# Altium schematic sheet POWER_IO.SchDoc
size A4
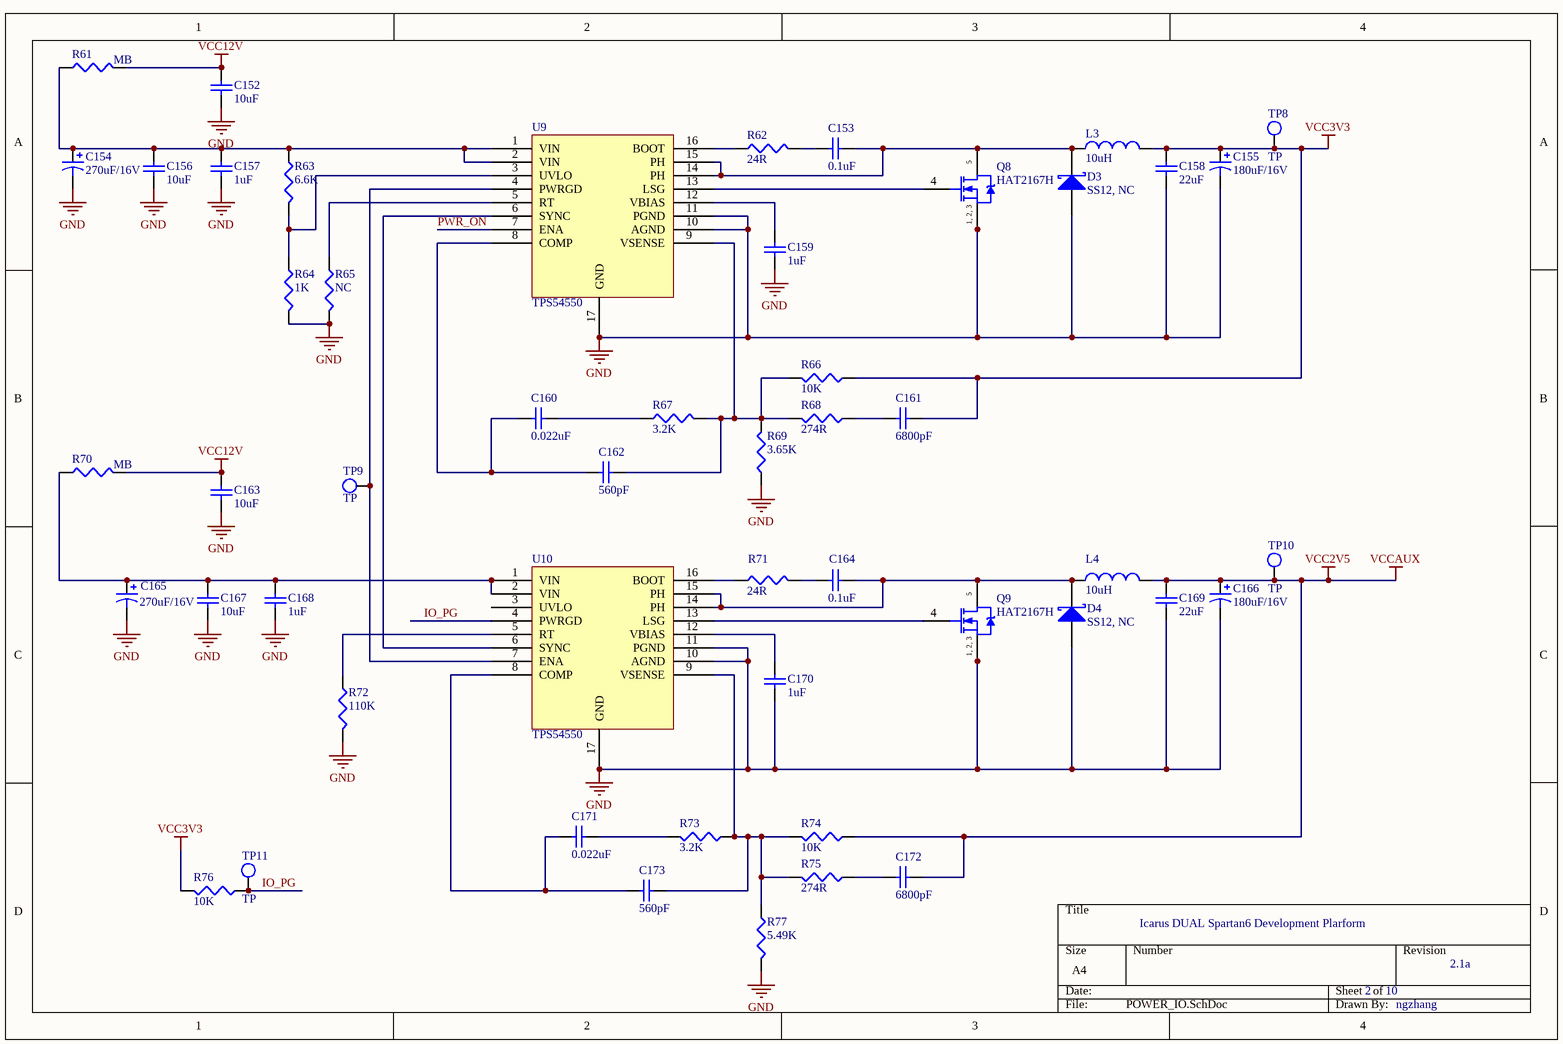
[diagram p0: POWER_IO.SchDoc]

## Parts
C152  10uF  [C1206]
C153  0.1uF  [1608[0603]]
C154  270uF/16V  [CAP8X8]
C155  180uF/16V  [CAP8X8]
C156  10uF  [C1206]
C157  1uF  [1608[0603]]
C158  22uF  [C1206]
C159  1uF  [1608[0603]]
C160  0.022uF  [1608[0603]]
C161  6800pF  [1608[0603]]
C162  560pF  [1608[0603]]
C163  10uF  [C1206]
C164  0.1uF  [1608[0603]]
C165  270uF/16V  [CAP8X8]
C166  180uF/16V  [CAP8X8]
C167  10uF  [C1206]
C168  1uF  [1608[0603]]
C169  22uF  [C1206]
C170  1uF  [1608[0603]]
C171  0.022uF  [1608[0603]]
C172  6800pF  [1608[0603]]
C173  560pF  [1608[0603]]
D3  SS12, NC  [SMA]
D4  SS12, NC  [SMA]
L3  value 10uH  [IHLP4040]  (hidden comment: IHLP4040DZ11)
L4  value 10uH  [IHLP4040]  (hidden comment: IHLP4040DZ11)
Q8  HAT2167H  [LFPAK]
Q9  HAT2167H  [LFPAK]
R61  MB  [C1206]
R62  24R  [J1-0603]
R63  6.6K  [J1-0603]
R64  1K  [J1-0603]
R65  NC  [J1-0603]
R66  10K  [J1-0603]
R67  3.2K  [J1-0603]
R68  274R  [J1-0603]
R69  3.65K  [J1-0603]
R70  MB  [C1206]
R71  24R  [J1-0603]
R72  110K  [J1-0603]
R73  3.2K  [J1-0603]
R74  10K  [J1-0603]
R75  274R  [J1-0603]
R76  10K  [J1-0603]
R77  5.49K  [J1-0603]
TP8  TP  [TP]
TP9  TP  [TP]
TP10  TP  [TP]
TP11  TP  [TP]
U9  TPS54550  [TSSOP16_PP]
U10  TPS54550  [TSSOP16_PP]

## Nets
GND: C152.1 C154.2 C155.2 C156.1 C157.1 C158.1 C159.1 C163.1 C165.2 C166.2 C167.1 C168.1 C169.1 C170.2 D3.1(A) D4.1(A) Q8.1(S) Q8.2(S) Q8.3(S) Q9.1(S) Q9.2(S) Q9.3(S) R64.2 R65.2 R69.1 R72.2 R77.2 U9.10(AGND) U9.11(PGND) U9.17(GND) U10.10(AGND) U10.11(PGND) U10.17(GND)
VCC2V5: C166.1 C169.2 C172.2 L4.2 R74.1 TP10.1(TP)  [also labelled VCCAUX]
VCC3V3: C155.1 C158.2 C161.2 L3.2 R66.1 R76.2 TP8.1(TP)
VCC12V: C152.2 C163.2 R61.2 R70.2
IO_PG: R76.1 TP11.1(TP) U10.4(PWRGD)
PWR_ON: U9.7(ENA)
NetC153_1: C153.1 R62.2
NetC153_2: C153.2 D3.2(K) L3.1 Q8.5(D) U9.14(PH) U9.15(PH)
NetC154_1: C154.1 C156.2 C157.2 R61.1 R63.1 U9.1(VIN) U9.2(VIN)
NetC159_2: C159.2 U9.12(VBIAS)
NetC160_1: C160.1 C162.1 U9.8(COMP)
NetC160_2: C160.2 R67.1
NetC161_1: C161.1 R68.1
NetC162_2: C162.2 R66.2 R67.2 R68.2 R69.2 U9.9(VSENSE)
NetC164_1: C164.1 D4.2(K) L4.1 Q9.5(D) U10.14(PH) U10.15(PH)
NetC164_2: C164.2 R71.2
NetC165_1: C165.1 C167.2 C168.2 R70.1 U10.1(VIN) U10.2(VIN)
NetC170_1: C170.1 U10.12(VBIAS)
NetC171_1: C171.1 C173.1 U10.8(COMP)
NetC171_2: C171.2 R73.2
NetC172_1: C172.1 R75.1
NetC173_2: C173.2 R73.1 R74.2 R75.2 R77.1 U10.9(VSENSE)
NetQ8_4: Q8.4(G) U9.13(LSG)
NetQ9_4: Q9.4(G) U10.13(LSG)
NetR62_1: R62.1 U9.16(BOOT)
NetR63_2: R63.2 R64.1 U9.3(UVLO)
NetR65_1: R65.1 U9.5(RT)
NetR71_1: R71.1 U10.16(BOOT)
NetR72_1: R72.1 U10.5(RT)
NetTP9_1: TP9.1(TP) U9.4(PWRGD) U10.7(ENA)
NetU9_6: U9.6(SYNC) U10.6(SYNC)

Not connected (* = marked no-connect by the designer): U10 3(UVLO)

## Notes on the sheet
- Icarus DUAL Spartan6 Development Plarform
- 2
- 10
- 2.1a
- ngzhang
- (in symbol HAT216X) 1, 2, 3

## Library data of the parts
C152 C153 C156-C164 C167-C173 = Cap Semi: Capacitor (Semiconductor SIM Model); Published: 8-Jun-2000; LatestRevisionDate: 29-May-2009; LatestRevisionNote: IPC-7351 Footprint Added.; PackageReference: C1206; Publisher: Altium Limited; PackageDescription: Chip Capacitor
  C152 C156 C163 C167: Value: 10uF
  C153 C164: Value: 0.1uF
  C157 C159 C168 C170: Value: 1uF
  C158 C169: Value: 22uF
  C160 C171: Value: 0.022uF
  C161 C172: Value: 6800pF
  C162 C173: Value: 560pF
C154 C155 C165 C166 = Cap Pol3: Polarized Capacitor (Surface Mount); Published: 8-Jun-2000; LatestRevisionDate: 29-May-2009; LatestRevisionNote: IPC-7351 Footprint Added.; PackageReference: C0805; Publisher: Altium Limited; PackageDescription: Chip Capacitor
  C154 C165: Value: 270uF/16V
  C155 C166: Value: 180uF/16V
D3 D4 = 10MQ060N: Schottky Rectifier; Published: 17-Sep-2003; DatasheetVersion: May-2002; PackageVersion: revH, May-2002; PackageReference: SMA; Publisher: Altium Limited; PackageDescription: DO-214-AC/SMA; 2 C-Bend Leads; Body 5 x 2.7 mm, inc. leads (LxW); ComponentLink1Description: Manufacturer Link; ComponentLink1URL: http://www.irf.com/; ComponentLink2Description: Datasheet; ComponentLink2URL: http://www.irf.com/product-info/datasheets/data/10MQ060N.pdf
L3 L4 = Inductor: Code_IEC: 1005; Published: 8-Jun-2000; LatestRevisionDate: 29-May-2009; LatestRevisionNote: IPC-7351 Footprint Added.; PackageReference: 0402-A; Publisher: Altium Limited; PackageDescription: Chip Inductor; Code_JEITA: 0402
Q8 Q9 = HAT216X
R61-R77 = Res3: Resistor; Published: 8-Jun-2000; LatestRevisionDate: 29-May-2009; LatestRevisionNote: IPC-7351 Footprint Added.; PackageReference: J1-0603; Publisher: Altium Limited; PackageDescription: Chip Resistor
  R61 R70: Value: MB
  R62 R71: Value: 24R
  R63: Value: 6.6K
  R64: Value: 1K
  R65: Value: NC
  R66 R74 R76: Value: 10K
  R67 R73: Value: 3.2K
  R68 R75: Value: 274R
  R69: Value: 3.65K
  R72: Value: 110K
  R77: Value: 5.49K
U9 U10 = TPS54350